# EAGLE design occupancy-sensor (EAGLE 7.4.0)
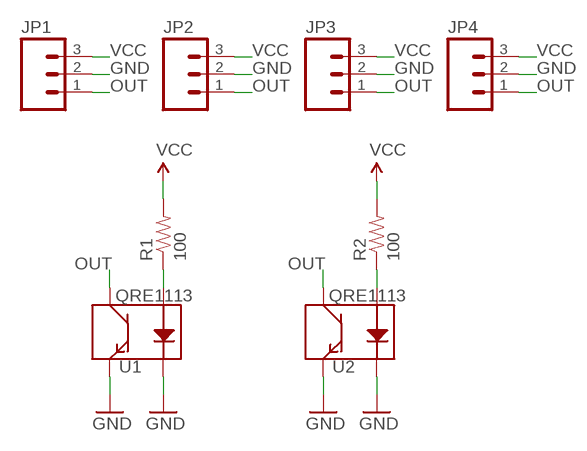
[diagram p0: schematic, sheet 1]

## Parts
JP1  M031X03_NO_SILK  [1X03_NO_SILK]
JP2  M031X03_NO_SILK  [1X03_NO_SILK]
JP3  M031X03_NO_SILK  [1X03_NO_SILK]
JP4  M031X03_NO_SILK  [1X03_NO_SILK]
R1  100  RESISTOR0603-RES  [0603-RES]
R2  100  RESISTOR0603-RES  [0603-RES]
U1  QRE1113  QRE1113SMD-W  [QRE1113-W]
U2  QRE1113  QRE1113SMD-W  [QRE1113-W]

## Nets
GND: JP1.2 JP2.2 JP3.2 JP4.2 U1.2(K) U1.4(E) U2.2(K) U2.4(E)
N$1: R1.1 U1.1(A)
N$2: R2.1 U2.1(A)
OUT: JP1.1 JP2.1 JP3.1 JP4.1 U1.3(C) U2.3(C)
VCC: JP1.3 JP2.3 JP3.3 JP4.3 R1.2 R2.2

## Library data of the parts
JP1-JP4 = SparkFun-Connectors:M03: Header 3 Standard 3-pin 0.1" header. Use with straight break away headers (SKU : PRT-00116), right angle break away headers (PRT-00553), swiss pins (PRT-00743), machine pins (PRT-00117), and female headers (PRT-00115). Molex polarized connector foot print use with SKU : PRT-08232 with associated crimp pins and housings.
R1 R2 = SparkFun-Passives:RESISTOR: Resistor Basic schematic elements and footprints for 0603, 1206, and PTH resistors.
U1 U2 = SparkFun-Sensors:QRE1113: Reflective object sensor

## Board
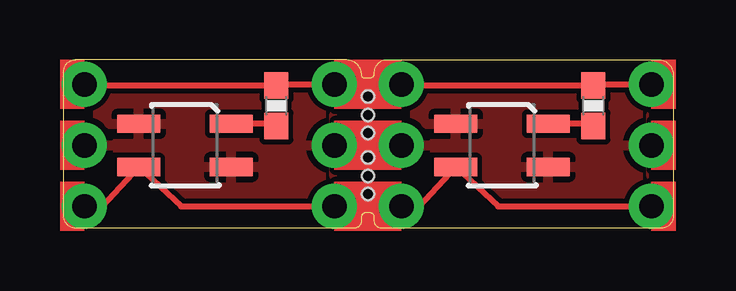
[diagram p1: board, top side]
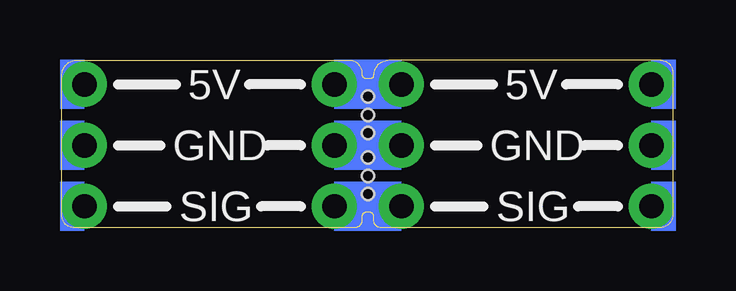
[diagram p2: board, bottom side, seen from below]

Size 25.45 x 6.99 mm. Coordinates in mm from the lower left corner, seen from the top.
Outline: 0,6.48 0,0.51 arc90 0.51,0 12.16,0 arc90 12.45,0.28 12.45,0.46 arc-90 12.63,0.64 12.77,0.64 arc-90 12.95,0.46 12.95,0.28 arc90 13.24,0 24.95,0 arc90 25.45,0.5 25.45,6.35 arc90 24.82,6.97 13.49,6.99 arc90 12.95,6.45 12.95,6.4 arc-90 12.77,6.22 12.57,6.22 arc-90 12.45,6.35 arc90 11.81,6.99 0.5,6.99 0.5,6.97 arc90 0,6.48
Copper layers (1*16): Top 0.035mm / dielectric 1.5mm / Bottom 0.035mm
Design rules "default": minimum track width 10mil, minimum drill 24mil, track to track 8mil, track to pad 8mil, pad to pad 8mil, via to via 8mil, smd to smd 8mil, copper to edge 40mil, drill to drill 8mil, minimum pad ring 10mil, minimum via ring 8mil, stop-mask expansion 4mil, vias tented up to drill 0mil, thermal gap 10mil
Holes 0.51 mm at 12.7,5.46 12.7,3.94 12.7,2.92 12.7,1.4 12.7,2.16 12.7,4.7

### Footprints (pad centres in the part's own frame; a part is rotated, then mirrored left to right if it is on the bottom)
1X03_NO_SILK = drill 1.016 pad 1.88: 1 0,0; 2 2.54,0; 3 5.08,0
0603-RES = smd 1.1 x 1: 1 -0.85,0; 2 0.85,0
QRE1113-W = smd 1.778 x 0.762: 1 -1.927,-0.9; 2 1.927,-0.9; 3 1.927,0.9; 4 -1.927,0.9

### Placement (x,y rotation side)
JP1  0.89,0.89 90 top
JP2  11.3,0.89 90 top
JP3  14.1,0.89 90 top
JP4  24.51,0.89 90 top
R1  8.89,5.08 90 top
R2  22.1,5.08 90 top
U1  5.08,3.43 180 top
U2  18.29,3.43 180 top

### Tracks (layer width: path | path; a pad name or v marks a point on that pad's centre or on a via)
GND
  Top 0.254: JP2.2 JP3.2
  pour Top: -1.27,0 52.07,0 52.07,33.02 -1.27,33.02
N$1
  Top 0.254: R1.1 8.79,4.33 U1.1
N$2
  Top 0.254: R2.1 22,4.33 U2.1
OUT
  Top 0.254: JP1.1 1.64,0.89 U1.3 4.92,0.89 JP2.1 JP3.1 14.85,0.89 U2.3 18.13,0.89 JP4.1
VCC
  Top 0.254: JP1.3 0.93,5.93 R1.2 8.93,5.97 JP2.3 JP3.3 14.14,5.93 R2.2 22.14,5.97 JP4.3
(copper drawn outside any net)
  shapes: Bottom area x9, Top area x9

### Text on the board
bPlace: 5V | 5V | GND | GND | SIG | SIG